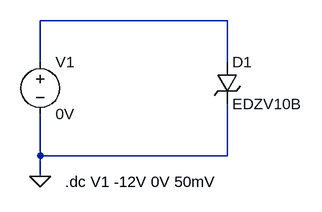
[diagram p0: schematic E2-curva-zener.asc]
E2-curva-zener.asc, the LTspice schematic file:
Version 4
SHEET 1 880 680
WIRE 208 80 -80 80
WIRE -80 144 -80 80
WIRE 208 144 208 80
WIRE -80 288 -80 224
WIRE 208 288 208 208
WIRE 208 288 -80 288
WIRE -80 320 -80 288
FLAG -80 320 0
SYMBOL voltage -80 128 R0
WINDOW 123 0 0 Left 0
WINDOW 39 0 0 Left 0
SYMATTR InstName V1
SYMATTR Value 0V
SYMBOL zener 192 144 R0
SYMATTR InstName D1
SYMATTR Value EDZV10B
TEXT -42 328 Left 2 !.dc V1 -12V 0V 50mV

The netlist it stands for:
* E2-curva-zener.asc
V1 N001 0 0V
D1 N001 0 EDZV10B
.model D D
.lib standard.dio
.dc V1 -12V 0V 50mV
.backanno
.end